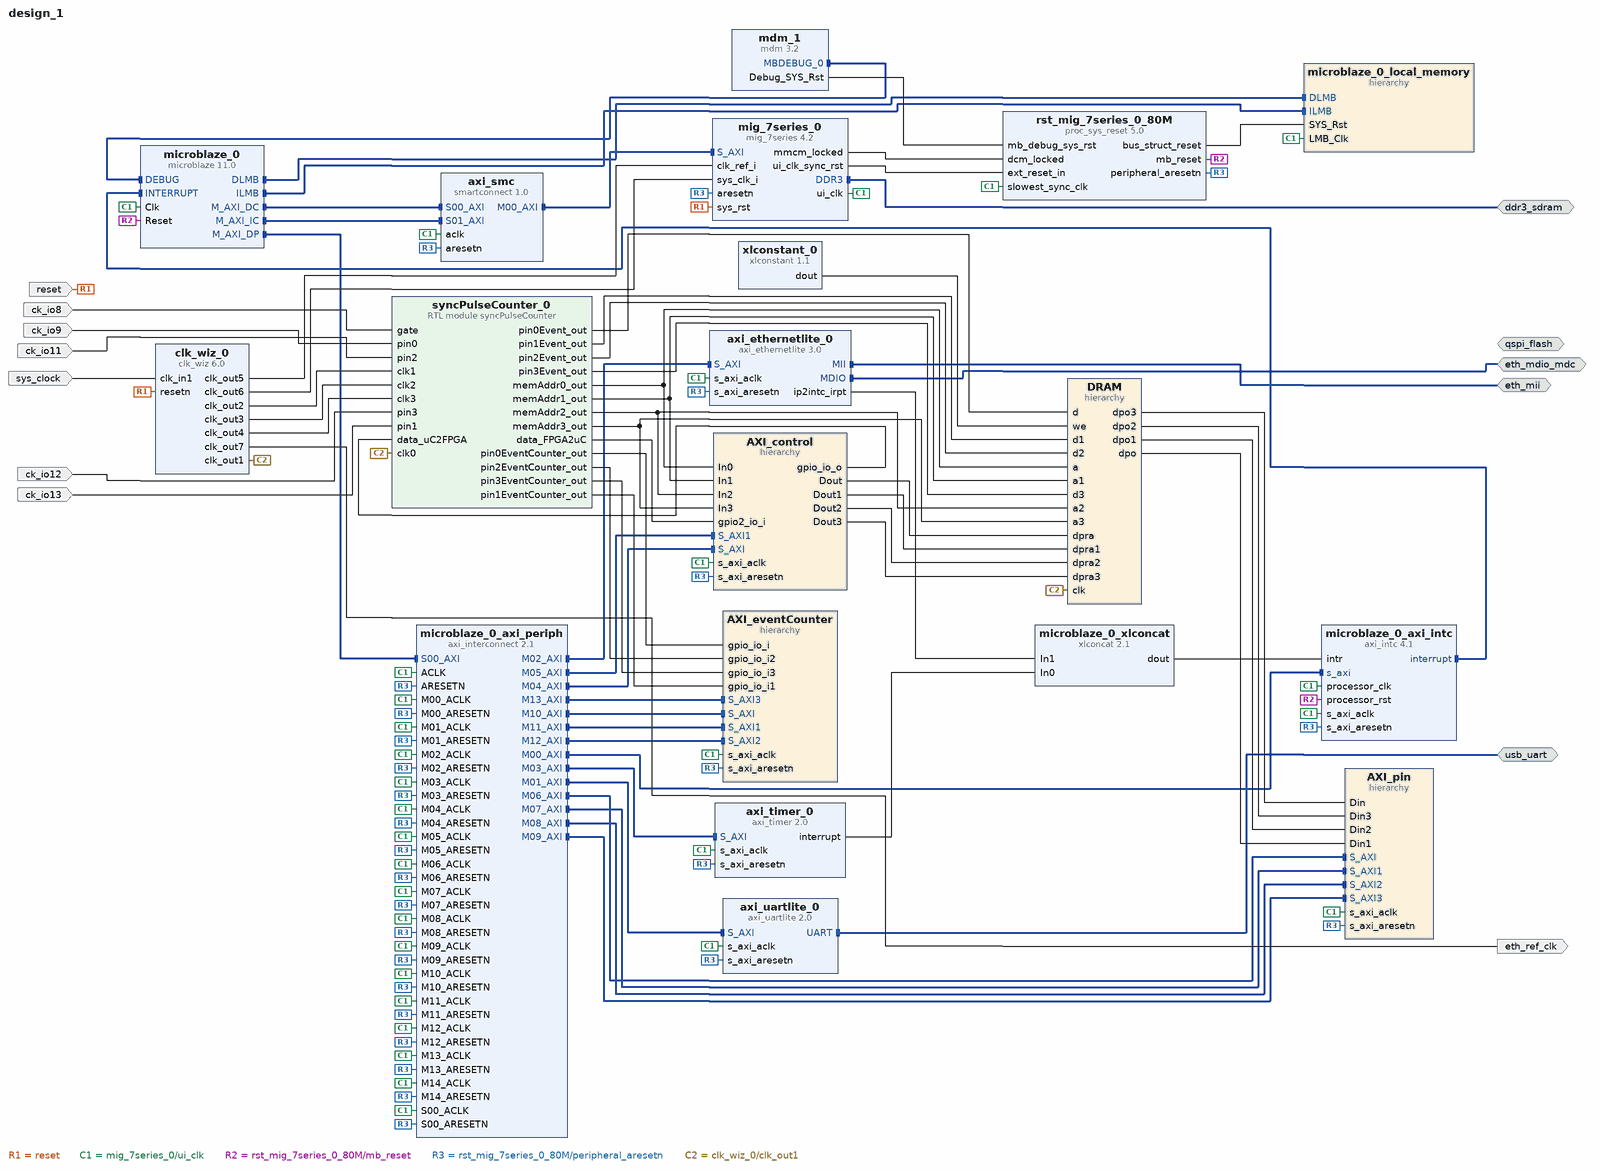
[diagram p0: block diagram of the top level]
# Vivado block design design_1, xc7a35ticsg324-1L, Vivado 2018.3
create_bd_design design_1

create_bd_intf_port -mode Master -vlnv xilinx.com:interface:ddrx_rtl:1.0 ddr3_sdram
create_bd_intf_port -mode Master -vlnv xilinx.com:interface:uart_rtl:1.0 usb_uart
create_bd_intf_port -mode Master -vlnv xilinx.com:interface:mii_rtl:1.0 eth_mii
create_bd_intf_port -mode Master -vlnv xilinx.com:interface:mdio_rtl:1.0 eth_mdio_mdc
create_bd_intf_port -mode Master -vlnv xilinx.com:interface:spi_rtl:1.0 qspi_flash
create_bd_port -dir I ck_io8
create_bd_port -dir I ck_io9
create_bd_port -dir I ck_io11
create_bd_port -dir I ck_io12
create_bd_port -dir I -type rst reset
set_property -dict {CONFIG.POLARITY ACTIVE_LOW} [get_bd_ports reset]
create_bd_port -dir I -type clk sys_clock
set_property -dict {CONFIG.FREQ_HZ 100000000 CONFIG.PHASE 0.000} [get_bd_ports sys_clock]
create_bd_port -dir O -type clk eth_ref_clk
create_bd_port -dir I ck_io13

create_bd_cell -type ip -vlnv xilinx.com:ip:clk_wiz:6.0 clk_wiz_0
set_property -dict [list \
  CONFIG.CLKOUT1_JITTER 126.455 \
  CONFIG.CLKOUT1_PHASE_ERROR 114.212 \
  CONFIG.CLKOUT1_REQUESTED_OUT_FREQ 200 \
  CONFIG.CLKOUT2_JITTER 126.455 \
  CONFIG.CLKOUT2_PHASE_ERROR 114.212 \
  CONFIG.CLKOUT2_REQUESTED_OUT_FREQ 200 \
  CONFIG.CLKOUT2_REQUESTED_PHASE 45 \
  CONFIG.CLKOUT2_USED true \
  CONFIG.CLKOUT3_JITTER 126.455 \
  CONFIG.CLKOUT3_PHASE_ERROR 114.212 \
  CONFIG.CLKOUT3_REQUESTED_OUT_FREQ 200 \
  CONFIG.CLKOUT3_REQUESTED_PHASE 90 \
  CONFIG.CLKOUT3_USED true \
  CONFIG.CLKOUT4_JITTER 126.455 \
  CONFIG.CLKOUT4_PHASE_ERROR 114.212 \
  CONFIG.CLKOUT4_REQUESTED_OUT_FREQ 200 \
  CONFIG.CLKOUT4_REQUESTED_PHASE 135 \
  CONFIG.CLKOUT4_USED true \
  CONFIG.CLKOUT5_JITTER 126.455 \
  CONFIG.CLKOUT5_PHASE_ERROR 114.212 \
  CONFIG.CLKOUT5_REQUESTED_OUT_FREQ 200 \
  CONFIG.CLKOUT5_USED true \
  CONFIG.CLKOUT6_JITTER 111.164 \
  CONFIG.CLKOUT6_PHASE_ERROR 114.212 \
  CONFIG.CLKOUT6_REQUESTED_OUT_FREQ 400 \
  CONFIG.CLKOUT6_USED true \
  CONFIG.CLKOUT7_JITTER 191.696 \
  CONFIG.CLKOUT7_PHASE_ERROR 114.212 \
  CONFIG.CLKOUT7_REQUESTED_OUT_FREQ 25 \
  CONFIG.CLKOUT7_USED true \
  CONFIG.CLK_IN1_BOARD_INTERFACE sys_clock \
  CONFIG.MMCM_CLKFBOUT_MULT_F 8.000 \
  CONFIG.MMCM_CLKIN1_PERIOD 10.000 \
  CONFIG.MMCM_CLKIN2_PERIOD 10.000 \
  CONFIG.MMCM_CLKOUT0_DIVIDE_F 4.000 \
  CONFIG.MMCM_CLKOUT1_DIVIDE 4 \
  CONFIG.MMCM_CLKOUT1_PHASE 45.000 \
  CONFIG.MMCM_CLKOUT2_DIVIDE 4 \
  CONFIG.MMCM_CLKOUT2_PHASE 90.000 \
  CONFIG.MMCM_CLKOUT3_DIVIDE 4 \
  CONFIG.MMCM_CLKOUT3_PHASE 135.000 \
  CONFIG.MMCM_CLKOUT4_DIVIDE 4 \
  CONFIG.MMCM_CLKOUT5_DIVIDE 2 \
  CONFIG.MMCM_CLKOUT6_DIVIDE 32 \
  CONFIG.MMCM_DIVCLK_DIVIDE 1 \
  CONFIG.NUM_OUT_CLKS 7 \
  CONFIG.RESET_BOARD_INTERFACE reset \
  CONFIG.RESET_PORT resetn \
  CONFIG.RESET_TYPE ACTIVE_LOW \
  CONFIG.USE_BOARD_FLOW true \
] [get_bd_cells clk_wiz_0]
create_bd_cell -type ip -vlnv xilinx.com:ip:xlconstant:1.1 xlconstant_0
create_bd_cell -type hier DRAM
create_bd_cell -type hier AXI_pin
create_bd_cell -type hier AXI_control
create_bd_cell -type ip -vlnv xilinx.com:ip:mig_7series:4.2 mig_7series_0
set_property -dict [list \
  CONFIG.BOARD_MIG_PARAM ddr3_sdram \
  CONFIG.MIG_DONT_TOUCH_PARAM Custom \
  CONFIG.RESET_BOARD_INTERFACE reset \
  CONFIG.XML_INPUT_FILE mig_b.prj \
] [get_bd_cells mig_7series_0]
create_bd_cell -type ip -vlnv xilinx.com:ip:axi_uartlite:2.0 axi_uartlite_0
set_property -dict {CONFIG.UARTLITE_BOARD_INTERFACE usb_uart CONFIG.USE_BOARD_FLOW true} [get_bd_cells axi_uartlite_0]
create_bd_cell -type ip -vlnv xilinx.com:ip:microblaze:11.0 microblaze_0
set_property -dict [list \
  CONFIG.C_CACHE_BYTE_SIZE 16384 \
  CONFIG.C_DCACHE_BYTE_SIZE 16384 \
  CONFIG.C_DEBUG_ENABLED 1 \
  CONFIG.C_D_AXI 1 \
  CONFIG.C_D_LMB 1 \
  CONFIG.C_I_LMB 1 \
  CONFIG.C_USE_DCACHE 1 \
  CONFIG.C_USE_ICACHE 1 \
] [get_bd_cells microblaze_0]
create_bd_cell -type hier microblaze_0_local_memory
create_bd_cell -type ip -vlnv xilinx.com:ip:axi_interconnect:2.1 microblaze_0_axi_periph
set_property -dict {CONFIG.NUM_MI 15} [get_bd_cells microblaze_0_axi_periph]
create_bd_cell -type ip -vlnv xilinx.com:ip:axi_intc:4.1 microblaze_0_axi_intc
set_property -dict {CONFIG.C_HAS_FAST 1} [get_bd_cells microblaze_0_axi_intc]
create_bd_cell -type ip -vlnv xilinx.com:ip:xlconcat:2.1 microblaze_0_xlconcat
create_bd_cell -type ip -vlnv xilinx.com:ip:mdm:3.2 mdm_1
create_bd_cell -type ip -vlnv xilinx.com:ip:proc_sys_reset:5.0 rst_mig_7series_0_80M
create_bd_cell -type ip -vlnv xilinx.com:ip:axi_ethernetlite:3.0 axi_ethernetlite_0
set_property -dict [list \
  CONFIG.MDIO_BOARD_INTERFACE eth_mdio_mdc \
  CONFIG.MII_BOARD_INTERFACE eth_mii \
  CONFIG.USE_BOARD_FLOW true \
] [get_bd_cells axi_ethernetlite_0]
create_bd_cell -type ip -vlnv xilinx.com:ip:axi_timer:2.0 axi_timer_0
create_bd_cell -type ip -vlnv xilinx.com:ip:smartconnect:1.0 axi_smc
set_property -dict {CONFIG.NUM_SI 2} [get_bd_cells axi_smc]
create_bd_cell -type hier AXI_eventCounter
create_bd_cell -type module -reference syncPulseCounter syncPulseCounter_0

# ---- hierarchy /DRAM ----
current_bd_instance /DRAM
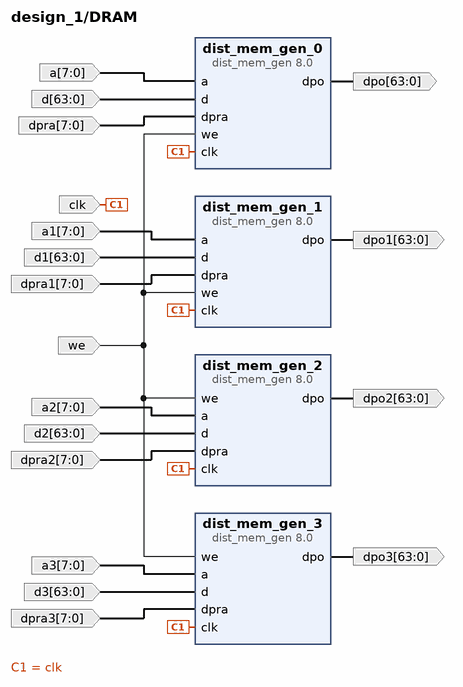
[diagram p1: block diagram inside /DRAM]
create_bd_pin -dir I -from 7 -to 0 a
create_bd_pin -dir I -from 63 -to 0 d
create_bd_pin -dir I -from 7 -to 0 dpra
create_bd_pin -dir I clk
create_bd_pin -dir I we
create_bd_pin -dir O -from 63 -to 0 dpo
create_bd_pin -dir I -from 7 -to 0 a1
create_bd_pin -dir I -from 63 -to 0 d1
create_bd_pin -dir I -from 7 -to 0 dpra1
create_bd_pin -dir O -from 63 -to 0 dpo1
create_bd_pin -dir I -from 7 -to 0 a2
create_bd_pin -dir I -from 63 -to 0 d2
create_bd_pin -dir I -from 7 -to 0 dpra2
create_bd_pin -dir O -from 63 -to 0 dpo2
create_bd_pin -dir I -from 7 -to 0 a3
create_bd_pin -dir I -from 63 -to 0 d3
create_bd_pin -dir I -from 7 -to 0 dpra3
create_bd_pin -dir O -from 63 -to 0 dpo3

create_bd_cell -type ip -vlnv xilinx.com:ip:dist_mem_gen:8.0 dist_mem_gen_0
set_property -dict {CONFIG.data_width 64 CONFIG.depth 256 CONFIG.memory_type dual_port_ram} [get_bd_cells dist_mem_gen_0]
create_bd_cell -type ip -vlnv xilinx.com:ip:dist_mem_gen:8.0 dist_mem_gen_1
set_property -dict {CONFIG.data_width 64 CONFIG.depth 256 CONFIG.memory_type dual_port_ram} [get_bd_cells dist_mem_gen_1]
create_bd_cell -type ip -vlnv xilinx.com:ip:dist_mem_gen:8.0 dist_mem_gen_2
set_property -dict {CONFIG.data_width 64 CONFIG.depth 256 CONFIG.memory_type dual_port_ram} [get_bd_cells dist_mem_gen_2]
create_bd_cell -type ip -vlnv xilinx.com:ip:dist_mem_gen:8.0 dist_mem_gen_3
set_property -dict {CONFIG.data_width 64 CONFIG.depth 256 CONFIG.memory_type dual_port_ram} [get_bd_cells dist_mem_gen_3]

# ---- hierarchy /AXI_pin ----
current_bd_instance /AXI_pin
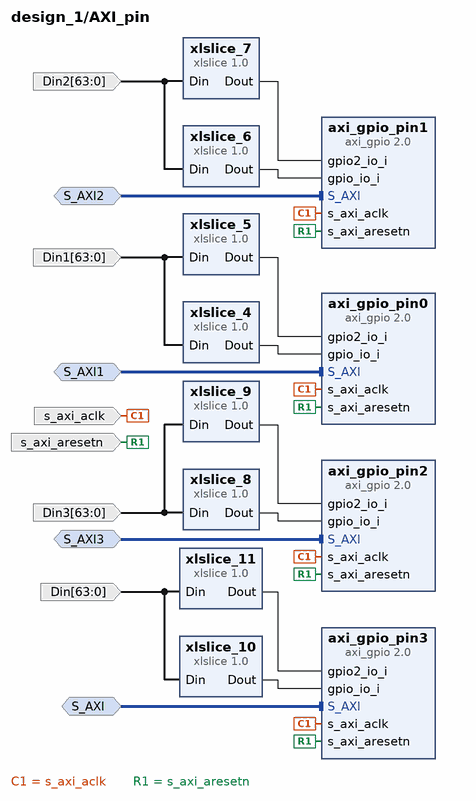
[diagram p2: block diagram inside /AXI_pin]
create_bd_intf_pin -mode Slave -vlnv xilinx.com:interface:aximm_rtl:1.0 S_AXI
create_bd_intf_pin -mode Slave -vlnv xilinx.com:interface:aximm_rtl:1.0 S_AXI1
create_bd_intf_pin -mode Slave -vlnv xilinx.com:interface:aximm_rtl:1.0 S_AXI2
create_bd_intf_pin -mode Slave -vlnv xilinx.com:interface:aximm_rtl:1.0 S_AXI3
create_bd_pin -dir I -from 63 -to 0 Din
create_bd_pin -dir I -from 63 -to 0 Din1
create_bd_pin -dir I -from 63 -to 0 Din2
create_bd_pin -dir I -from 63 -to 0 Din3
create_bd_pin -dir I -type clk s_axi_aclk
create_bd_pin -dir I -type rst s_axi_aresetn

create_bd_cell -type ip -vlnv xilinx.com:ip:axi_gpio:2.0 axi_gpio_pin3
set_property -dict [list \
  CONFIG.C_ALL_INPUTS 1 \
  CONFIG.C_ALL_INPUTS_2 1 \
  CONFIG.C_GPIO2_WIDTH 32 \
  CONFIG.C_IS_DUAL 1 \
] [get_bd_cells axi_gpio_pin3]
create_bd_cell -type ip -vlnv xilinx.com:ip:xlslice:1.0 xlslice_10
set_property -dict {CONFIG.DIN_FROM 31 CONFIG.DIN_TO 0 CONFIG.DIN_WIDTH 64 CONFIG.DOUT_WIDTH 32} [get_bd_cells xlslice_10]
create_bd_cell -type ip -vlnv xilinx.com:ip:xlslice:1.0 xlslice_4
set_property -dict {CONFIG.DIN_FROM 31 CONFIG.DIN_TO 0 CONFIG.DIN_WIDTH 64 CONFIG.DOUT_WIDTH 32} [get_bd_cells xlslice_4]
create_bd_cell -type ip -vlnv xilinx.com:ip:xlslice:1.0 xlslice_5
set_property -dict {CONFIG.DIN_FROM 63 CONFIG.DIN_TO 32 CONFIG.DIN_WIDTH 64 CONFIG.DOUT_WIDTH 32} [get_bd_cells xlslice_5]
create_bd_cell -type ip -vlnv xilinx.com:ip:xlslice:1.0 xlslice_6
set_property -dict {CONFIG.DIN_FROM 31 CONFIG.DIN_TO 0 CONFIG.DIN_WIDTH 64 CONFIG.DOUT_WIDTH 32} [get_bd_cells xlslice_6]
create_bd_cell -type ip -vlnv xilinx.com:ip:axi_gpio:2.0 axi_gpio_pin0
set_property -dict [list \
  CONFIG.C_ALL_INPUTS 1 \
  CONFIG.C_ALL_INPUTS_2 1 \
  CONFIG.C_GPIO2_WIDTH 32 \
  CONFIG.C_IS_DUAL 1 \
] [get_bd_cells axi_gpio_pin0]
create_bd_cell -type ip -vlnv xilinx.com:ip:xlslice:1.0 xlslice_7
set_property -dict {CONFIG.DIN_FROM 63 CONFIG.DIN_TO 32 CONFIG.DIN_WIDTH 64 CONFIG.DOUT_WIDTH 1} [get_bd_cells xlslice_7]
create_bd_cell -type ip -vlnv xilinx.com:ip:xlslice:1.0 xlslice_8
set_property -dict {CONFIG.DIN_FROM 31 CONFIG.DIN_TO 0 CONFIG.DIN_WIDTH 64 CONFIG.DOUT_WIDTH 32} [get_bd_cells xlslice_8]
create_bd_cell -type ip -vlnv xilinx.com:ip:axi_gpio:2.0 axi_gpio_pin1
set_property -dict [list \
  CONFIG.C_ALL_INPUTS 1 \
  CONFIG.C_ALL_INPUTS_2 1 \
  CONFIG.C_GPIO2_WIDTH 32 \
  CONFIG.C_IS_DUAL 1 \
] [get_bd_cells axi_gpio_pin1]
create_bd_cell -type ip -vlnv xilinx.com:ip:axi_gpio:2.0 axi_gpio_pin2
set_property -dict [list \
  CONFIG.C_ALL_INPUTS 1 \
  CONFIG.C_ALL_INPUTS_2 1 \
  CONFIG.C_GPIO2_WIDTH 32 \
  CONFIG.C_IS_DUAL 1 \
] [get_bd_cells axi_gpio_pin2]
create_bd_cell -type ip -vlnv xilinx.com:ip:xlslice:1.0 xlslice_9
set_property -dict {CONFIG.DIN_FROM 63 CONFIG.DIN_TO 32 CONFIG.DIN_WIDTH 64 CONFIG.DOUT_WIDTH 1} [get_bd_cells xlslice_9]
create_bd_cell -type ip -vlnv xilinx.com:ip:xlslice:1.0 xlslice_11
set_property -dict {CONFIG.DIN_FROM 63 CONFIG.DIN_TO 32 CONFIG.DIN_WIDTH 64 CONFIG.DOUT_WIDTH 1} [get_bd_cells xlslice_11]

# ---- hierarchy /AXI_control ----
current_bd_instance /AXI_control
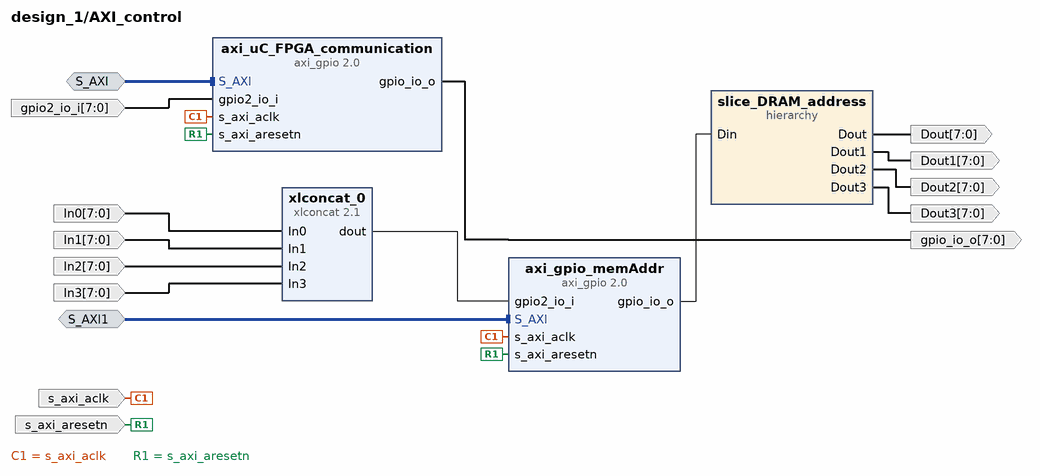
[diagram p3: block diagram inside /AXI_control]
create_bd_intf_pin -mode Slave -vlnv xilinx.com:interface:aximm_rtl:1.0 S_AXI
create_bd_intf_pin -mode Slave -vlnv xilinx.com:interface:aximm_rtl:1.0 S_AXI1
create_bd_pin -dir O -from 7 -to 0 gpio_io_o
create_bd_pin -dir I -from 7 -to 0 gpio2_io_i
create_bd_pin -dir I -from 7 -to 0 In0
create_bd_pin -dir I -from 7 -to 0 In1
create_bd_pin -dir I -from 7 -to 0 In2
create_bd_pin -dir I -from 7 -to 0 In3
create_bd_pin -dir O -from 7 -to 0 Dout
create_bd_pin -dir O -from 7 -to 0 Dout1
create_bd_pin -dir O -from 7 -to 0 Dout2
create_bd_pin -dir O -from 7 -to 0 Dout3
create_bd_pin -dir I -type clk s_axi_aclk
create_bd_pin -dir I -type rst s_axi_aresetn

create_bd_cell -type ip -vlnv xilinx.com:ip:axi_gpio:2.0 axi_uC_FPGA_communication
set_property -dict [list \
  CONFIG.C_ALL_INPUTS 0 \
  CONFIG.C_ALL_INPUTS_2 1 \
  CONFIG.C_ALL_OUTPUTS 1 \
  CONFIG.C_GPIO2_WIDTH 8 \
  CONFIG.C_GPIO_WIDTH 8 \
  CONFIG.C_IS_DUAL 1 \
] [get_bd_cells axi_uC_FPGA_communication]
create_bd_cell -type ip -vlnv xilinx.com:ip:axi_gpio:2.0 axi_gpio_memAddr
set_property -dict [list \
  CONFIG.C_ALL_INPUTS 0 \
  CONFIG.C_ALL_INPUTS_2 1 \
  CONFIG.C_ALL_OUTPUTS 1 \
  CONFIG.C_GPIO2_WIDTH 32 \
  CONFIG.C_GPIO_WIDTH 32 \
  CONFIG.C_IS_DUAL 1 \
] [get_bd_cells axi_gpio_memAddr]
create_bd_cell -type ip -vlnv xilinx.com:ip:xlconcat:2.1 xlconcat_0
set_property -dict [list \
  CONFIG.IN0_WIDTH 8 \
  CONFIG.IN1_WIDTH 8 \
  CONFIG.IN2_WIDTH 8 \
  CONFIG.IN3_WIDTH 8 \
  CONFIG.NUM_PORTS 4 \
] [get_bd_cells xlconcat_0]
create_bd_cell -type hier slice_DRAM_address

# ---- hierarchy /AXI_control/slice_DRAM_address ----
current_bd_instance /AXI_control/slice_DRAM_address
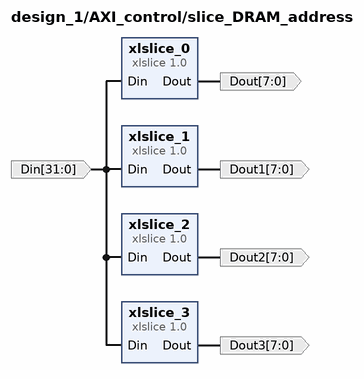
[diagram p4: block diagram inside /AXI_control/slice_DRAM_address]
create_bd_pin -dir I -from 31 -to 0 Din
create_bd_pin -dir O -from 7 -to 0 Dout
create_bd_pin -dir O -from 7 -to 0 Dout1
create_bd_pin -dir O -from 7 -to 0 Dout2
create_bd_pin -dir O -from 7 -to 0 Dout3

create_bd_cell -type ip -vlnv xilinx.com:ip:xlslice:1.0 xlslice_0
set_property -dict {CONFIG.DIN_FROM 7 CONFIG.DOUT_WIDTH 8} [get_bd_cells xlslice_0]
create_bd_cell -type ip -vlnv xilinx.com:ip:xlslice:1.0 xlslice_1
set_property -dict {CONFIG.DIN_FROM 15 CONFIG.DIN_TO 8 CONFIG.DOUT_WIDTH 8} [get_bd_cells xlslice_1]
create_bd_cell -type ip -vlnv xilinx.com:ip:xlslice:1.0 xlslice_2
set_property -dict {CONFIG.DIN_FROM 23 CONFIG.DIN_TO 16 CONFIG.DOUT_WIDTH 8} [get_bd_cells xlslice_2]
create_bd_cell -type ip -vlnv xilinx.com:ip:xlslice:1.0 xlslice_3
set_property -dict {CONFIG.DIN_FROM 31 CONFIG.DIN_TO 24 CONFIG.DOUT_WIDTH 8} [get_bd_cells xlslice_3]

# ---- hierarchy /microblaze_0_local_memory ----
current_bd_instance /microblaze_0_local_memory
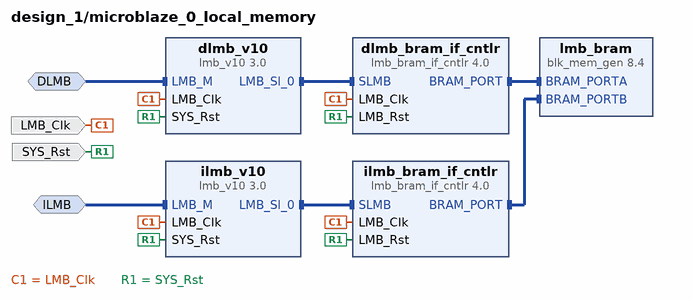
[diagram p5: block diagram inside /microblaze_0_local_memory]
create_bd_intf_pin -mode MirroredMaster -vlnv xilinx.com:interface:lmb_rtl:1.0 DLMB
create_bd_intf_pin -mode MirroredMaster -vlnv xilinx.com:interface:lmb_rtl:1.0 ILMB
create_bd_pin -dir I -type clk LMB_Clk
create_bd_pin -dir I -type rst SYS_Rst

create_bd_cell -type ip -vlnv xilinx.com:ip:lmb_v10:3.0 dlmb_v10
create_bd_cell -type ip -vlnv xilinx.com:ip:lmb_v10:3.0 ilmb_v10
create_bd_cell -type ip -vlnv xilinx.com:ip:lmb_bram_if_cntlr:4.0 dlmb_bram_if_cntlr
set_property -dict {CONFIG.C_ECC 0} [get_bd_cells dlmb_bram_if_cntlr]
create_bd_cell -type ip -vlnv xilinx.com:ip:lmb_bram_if_cntlr:4.0 ilmb_bram_if_cntlr
set_property -dict {CONFIG.C_ECC 0} [get_bd_cells ilmb_bram_if_cntlr]
create_bd_cell -type ip -vlnv xilinx.com:ip:blk_mem_gen:8.4 lmb_bram
set_property -dict {CONFIG.Memory_Type True_Dual_Port_RAM CONFIG.use_bram_block BRAM_Controller} [get_bd_cells lmb_bram]

# ---- hierarchy /AXI_eventCounter ----
current_bd_instance /AXI_eventCounter
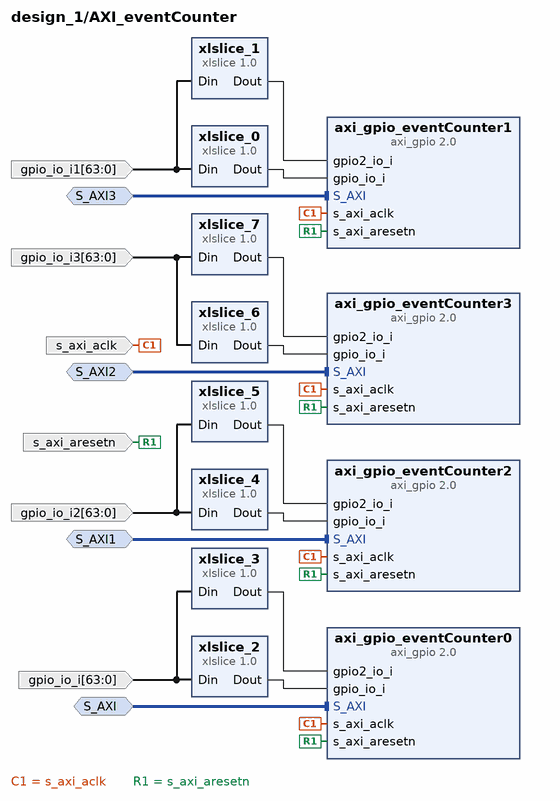
[diagram p6: block diagram inside /AXI_eventCounter]
create_bd_intf_pin -mode Slave -vlnv xilinx.com:interface:aximm_rtl:1.0 S_AXI
create_bd_intf_pin -mode Slave -vlnv xilinx.com:interface:aximm_rtl:1.0 S_AXI1
create_bd_intf_pin -mode Slave -vlnv xilinx.com:interface:aximm_rtl:1.0 S_AXI2
create_bd_intf_pin -mode Slave -vlnv xilinx.com:interface:aximm_rtl:1.0 S_AXI3
create_bd_pin -dir I -from 63 -to 0 gpio_io_i
create_bd_pin -dir I -from 63 -to 0 gpio_io_i2
create_bd_pin -dir I -from 63 -to 0 gpio_io_i3
create_bd_pin -dir I -from 63 -to 0 gpio_io_i1
create_bd_pin -dir I -type clk s_axi_aclk
create_bd_pin -dir I -type rst s_axi_aresetn

create_bd_cell -type ip -vlnv xilinx.com:ip:axi_gpio:2.0 axi_gpio_eventCounter0
set_property -dict {CONFIG.C_ALL_INPUTS 1 CONFIG.C_ALL_INPUTS_2 1 CONFIG.C_IS_DUAL 1} [get_bd_cells axi_gpio_eventCounter0]
create_bd_cell -type ip -vlnv xilinx.com:ip:axi_gpio:2.0 axi_gpio_eventCounter2
set_property -dict {CONFIG.C_ALL_INPUTS 1 CONFIG.C_ALL_INPUTS_2 1 CONFIG.C_IS_DUAL 1} [get_bd_cells axi_gpio_eventCounter2]
create_bd_cell -type ip -vlnv xilinx.com:ip:axi_gpio:2.0 axi_gpio_eventCounter3
set_property -dict {CONFIG.C_ALL_INPUTS 1 CONFIG.C_ALL_INPUTS_2 1 CONFIG.C_IS_DUAL 1} [get_bd_cells axi_gpio_eventCounter3]
create_bd_cell -type ip -vlnv xilinx.com:ip:axi_gpio:2.0 axi_gpio_eventCounter1
set_property -dict [list \
  CONFIG.C_ALL_INPUTS 1 \
  CONFIG.C_ALL_INPUTS_2 1 \
  CONFIG.C_INTERRUPT_PRESENT 0 \
  CONFIG.C_IS_DUAL 1 \
] [get_bd_cells axi_gpio_eventCounter1]
create_bd_cell -type ip -vlnv xilinx.com:ip:xlslice:1.0 xlslice_0
set_property -dict {CONFIG.DIN_FROM 31 CONFIG.DIN_TO 0 CONFIG.DIN_WIDTH 64 CONFIG.DOUT_WIDTH 32} [get_bd_cells xlslice_0]
create_bd_cell -type ip -vlnv xilinx.com:ip:xlslice:1.0 xlslice_1
set_property -dict {CONFIG.DIN_FROM 63 CONFIG.DIN_TO 32 CONFIG.DIN_WIDTH 64 CONFIG.DOUT_WIDTH 32} [get_bd_cells xlslice_1]
create_bd_cell -type ip -vlnv xilinx.com:ip:xlslice:1.0 xlslice_2
set_property -dict {CONFIG.DIN_FROM 31 CONFIG.DIN_TO 0 CONFIG.DIN_WIDTH 64 CONFIG.DOUT_WIDTH 32} [get_bd_cells xlslice_2]
create_bd_cell -type ip -vlnv xilinx.com:ip:xlslice:1.0 xlslice_3
set_property -dict {CONFIG.DIN_FROM 63 CONFIG.DIN_TO 32 CONFIG.DIN_WIDTH 64 CONFIG.DOUT_WIDTH 1} [get_bd_cells xlslice_3]
create_bd_cell -type ip -vlnv xilinx.com:ip:xlslice:1.0 xlslice_4
set_property -dict {CONFIG.DIN_FROM 31 CONFIG.DIN_TO 0 CONFIG.DIN_WIDTH 64 CONFIG.DOUT_WIDTH 32} [get_bd_cells xlslice_4]
create_bd_cell -type ip -vlnv xilinx.com:ip:xlslice:1.0 xlslice_5
set_property -dict {CONFIG.DIN_FROM 63 CONFIG.DIN_TO 32 CONFIG.DIN_WIDTH 64 CONFIG.DOUT_WIDTH 1} [get_bd_cells xlslice_5]
create_bd_cell -type ip -vlnv xilinx.com:ip:xlslice:1.0 xlslice_6
set_property -dict {CONFIG.DIN_FROM 31 CONFIG.DIN_TO 0 CONFIG.DIN_WIDTH 64 CONFIG.DOUT_WIDTH 32} [get_bd_cells xlslice_6]
create_bd_cell -type ip -vlnv xilinx.com:ip:xlslice:1.0 xlslice_7
set_property -dict {CONFIG.DIN_FROM 63 CONFIG.DIN_TO 32 CONFIG.DIN_WIDTH 64 CONFIG.DOUT_WIDTH 1} [get_bd_cells xlslice_7]

# ---- connections ----

current_bd_instance /DRAM
connect_bd_net -net syncPulseCounter_0_memAddr0_out [get_bd_pins a] [get_bd_pins dist_mem_gen_0/a]
connect_bd_net -net syncPulseCounter_0_pin0Event_out [get_bd_pins d] [get_bd_pins dist_mem_gen_0/d]
connect_bd_net -net xlslice_0_Dout [get_bd_pins dpra] [get_bd_pins dist_mem_gen_0/dpra]
connect_bd_net -net clk_wiz_0_clk_out1 [get_bd_pins clk] \
  [get_bd_pins dist_mem_gen_1/clk] [get_bd_pins dist_mem_gen_2/clk] [get_bd_pins dist_mem_gen_3/clk] \
  [get_bd_pins dist_mem_gen_0/clk]
connect_bd_net -net xlconstant_0_dout [get_bd_pins we] \
  [get_bd_pins dist_mem_gen_3/we] [get_bd_pins dist_mem_gen_2/we] [get_bd_pins dist_mem_gen_1/we] \
  [get_bd_pins dist_mem_gen_0/we]
connect_bd_net [get_bd_pins dist_mem_gen_0/dpo] [get_bd_pins dpo]
connect_bd_net -net syncPulseCounter_0_memAddr1_out [get_bd_pins a1] [get_bd_pins dist_mem_gen_1/a]
connect_bd_net -net syncPulseCounter_0_pin1Event_out [get_bd_pins d1] [get_bd_pins dist_mem_gen_1/d]
connect_bd_net -net xlslice_1_Dout [get_bd_pins dpra1] [get_bd_pins dist_mem_gen_1/dpra]
connect_bd_net [get_bd_pins dist_mem_gen_1/dpo] [get_bd_pins dpo1]
connect_bd_net -net syncPulseCounter_0_memAddr2_out [get_bd_pins a2] [get_bd_pins dist_mem_gen_2/a]
connect_bd_net -net syncPulseCounter_0_pin2Event_out [get_bd_pins d2] [get_bd_pins dist_mem_gen_2/d]
connect_bd_net -net xlslice_2_Dout [get_bd_pins dpra2] [get_bd_pins dist_mem_gen_2/dpra]
connect_bd_net [get_bd_pins dist_mem_gen_2/dpo] [get_bd_pins dpo2]
connect_bd_net -net syncPulseCounter_0_memAddr3_out [get_bd_pins a3] [get_bd_pins dist_mem_gen_3/a]
connect_bd_net -net syncPulseCounter_0_pin3Event_out [get_bd_pins d3] [get_bd_pins dist_mem_gen_3/d]
connect_bd_net -net xlslice_3_Dout [get_bd_pins dpra3] [get_bd_pins dist_mem_gen_3/dpra]
connect_bd_net [get_bd_pins dist_mem_gen_3/dpo] [get_bd_pins dpo3]

current_bd_instance /AXI_pin
connect_bd_intf_net [get_bd_intf_pins S_AXI2] [get_bd_intf_pins axi_gpio_pin1/S_AXI]
connect_bd_intf_net [get_bd_intf_pins S_AXI3] [get_bd_intf_pins axi_gpio_pin2/S_AXI]
connect_bd_intf_net [get_bd_intf_pins S_AXI] [get_bd_intf_pins axi_gpio_pin3/S_AXI]
connect_bd_intf_net [get_bd_intf_pins S_AXI1] [get_bd_intf_pins axi_gpio_pin0/S_AXI]
connect_bd_net [get_bd_pins xlslice_10/Dout] [get_bd_pins axi_gpio_pin3/gpio_io_i]
connect_bd_net [get_bd_pins xlslice_11/Dout] [get_bd_pins axi_gpio_pin3/gpio2_io_i]
connect_bd_net [get_bd_pins xlslice_4/Dout] [get_bd_pins axi_gpio_pin0/gpio_io_i]
connect_bd_net [get_bd_pins xlslice_5/Dout] [get_bd_pins axi_gpio_pin0/gpio2_io_i]
connect_bd_net [get_bd_pins xlslice_6/Dout] [get_bd_pins axi_gpio_pin1/gpio_io_i]
connect_bd_net [get_bd_pins xlslice_7/Dout] [get_bd_pins axi_gpio_pin1/gpio2_io_i]
connect_bd_net [get_bd_pins xlslice_8/Dout] [get_bd_pins axi_gpio_pin2/gpio_io_i]
connect_bd_net [get_bd_pins xlslice_9/Dout] [get_bd_pins axi_gpio_pin2/gpio2_io_i]
connect_bd_net [get_bd_pins Din] [get_bd_pins xlslice_11/Din] [get_bd_pins xlslice_10/Din]
connect_bd_net -net dist_mem_gen_0_dpo [get_bd_pins Din1] [get_bd_pins xlslice_5/Din] [get_bd_pins xlslice_4/Din]
connect_bd_net [get_bd_pins Din2] [get_bd_pins xlslice_7/Din] [get_bd_pins xlslice_6/Din]
connect_bd_net [get_bd_pins Din3] [get_bd_pins xlslice_9/Din] [get_bd_pins xlslice_8/Din]
connect_bd_net [get_bd_pins s_axi_aclk] \
  [get_bd_pins axi_gpio_pin3/s_axi_aclk] [get_bd_pins axi_gpio_pin0/s_axi_aclk] [get_bd_pins axi_gpio_pin1/s_axi_aclk] \
  [get_bd_pins axi_gpio_pin2/s_axi_aclk]
connect_bd_net [get_bd_pins s_axi_aresetn] \
  [get_bd_pins axi_gpio_pin3/s_axi_aresetn] [get_bd_pins axi_gpio_pin0/s_axi_aresetn] \
  [get_bd_pins axi_gpio_pin1/s_axi_aresetn] [get_bd_pins axi_gpio_pin2/s_axi_aresetn]

current_bd_instance /AXI_control
connect_bd_intf_net [get_bd_intf_pins S_AXI1] [get_bd_intf_pins axi_gpio_memAddr/S_AXI]
connect_bd_intf_net [get_bd_intf_pins S_AXI] [get_bd_intf_pins axi_uC_FPGA_communication/S_AXI]
connect_bd_net [get_bd_pins axi_gpio_memAddr/gpio_io_o] [get_bd_pins slice_DRAM_address/Din]
connect_bd_net [get_bd_pins xlconcat_0/dout] [get_bd_pins axi_gpio_memAddr/gpio2_io_i]
connect_bd_net -net axi_gpio_0_gpio_io_o [get_bd_pins axi_uC_FPGA_communication/gpio_io_o] [get_bd_pins gpio_io_o]
connect_bd_net -net syncPulseCounter_0_data_FPGA2uC [get_bd_pins gpio2_io_i] [get_bd_pins axi_uC_FPGA_communication/gpio2_io_i]
connect_bd_net -net syncPulseCounter_0_memAddr0_out [get_bd_pins In0] [get_bd_pins xlconcat_0/In0]
connect_bd_net -net syncPulseCounter_0_memAddr1_out [get_bd_pins In1] [get_bd_pins xlconcat_0/In1]
connect_bd_net -net syncPulseCounter_0_memAddr2_out [get_bd_pins In2] [get_bd_pins xlconcat_0/In2]
connect_bd_net -net syncPulseCounter_0_memAddr3_out [get_bd_pins In3] [get_bd_pins xlconcat_0/In3]
connect_bd_net -net xlslice_0_Dout [get_bd_pins slice_DRAM_address/Dout] [get_bd_pins Dout]
connect_bd_net -net xlslice_1_Dout [get_bd_pins slice_DRAM_address/Dout1] [get_bd_pins Dout1]
connect_bd_net -net xlslice_2_Dout [get_bd_pins slice_DRAM_address/Dout2] [get_bd_pins Dout2]
connect_bd_net -net xlslice_3_Dout [get_bd_pins slice_DRAM_address/Dout3] [get_bd_pins Dout3]
connect_bd_net [get_bd_pins s_axi_aclk] [get_bd_pins axi_uC_FPGA_communication/s_axi_aclk] [get_bd_pins axi_gpio_memAddr/s_axi_aclk]
connect_bd_net [get_bd_pins s_axi_aresetn] [get_bd_pins axi_uC_FPGA_communication/s_axi_aresetn] [get_bd_pins axi_gpio_memAddr/s_axi_aresetn]

current_bd_instance /AXI_control/slice_DRAM_address
connect_bd_net [get_bd_pins Din] [get_bd_pins xlslice_1/Din] [get_bd_pins xlslice_2/Din] [get_bd_pins xlslice_3/Din] [get_bd_pins xlslice_0/Din]
connect_bd_net [get_bd_pins xlslice_0/Dout] [get_bd_pins Dout]
connect_bd_net [get_bd_pins xlslice_1/Dout] [get_bd_pins Dout1]
connect_bd_net [get_bd_pins xlslice_2/Dout] [get_bd_pins Dout2]
connect_bd_net [get_bd_pins xlslice_3/Dout] [get_bd_pins Dout3]

current_bd_instance /microblaze_0_local_memory
connect_bd_intf_net -intf_net microblaze_0_dlmb_cntlr [get_bd_intf_pins dlmb_bram_if_cntlr/BRAM_PORT] [get_bd_intf_pins lmb_bram/BRAM_PORTA]
connect_bd_intf_net -intf_net microblaze_0_dlmb_bus [get_bd_intf_pins dlmb_v10/LMB_Sl_0] [get_bd_intf_pins dlmb_bram_if_cntlr/SLMB]
connect_bd_intf_net -intf_net microblaze_0_dlmb [get_bd_intf_pins DLMB] [get_bd_intf_pins dlmb_v10/LMB_M]
connect_bd_intf_net -intf_net microblaze_0_ilmb_bus [get_bd_intf_pins ilmb_v10/LMB_Sl_0] [get_bd_intf_pins ilmb_bram_if_cntlr/SLMB]
connect_bd_intf_net -intf_net microblaze_0_ilmb_cntlr [get_bd_intf_pins ilmb_bram_if_cntlr/BRAM_PORT] [get_bd_intf_pins lmb_bram/BRAM_PORTB]
connect_bd_intf_net -intf_net microblaze_0_ilmb [get_bd_intf_pins ILMB] [get_bd_intf_pins ilmb_v10/LMB_M]
connect_bd_net -net microblaze_0_Clk [get_bd_pins LMB_Clk] \
  [get_bd_pins dlmb_v10/LMB_Clk] [get_bd_pins dlmb_bram_if_cntlr/LMB_Clk] [get_bd_pins ilmb_v10/LMB_Clk] \
  [get_bd_pins ilmb_bram_if_cntlr/LMB_Clk]
connect_bd_net [get_bd_pins SYS_Rst] \
  [get_bd_pins dlmb_v10/SYS_Rst] [get_bd_pins dlmb_bram_if_cntlr/LMB_Rst] [get_bd_pins ilmb_v10/SYS_Rst] \
  [get_bd_pins ilmb_bram_if_cntlr/LMB_Rst]
set_property HDL_ATTRIBUTE.BMM_INFO_ADDRESS_SPACE {byte  0x00000000 32 > design_1 microblaze_0_local_memory/lmb_bram} [get_bd_cells dlmb_bram_if_cntlr]
set_property HDL_ATTRIBUTE.KEEP_HIERARCHY yes [get_bd_cells dlmb_bram_if_cntlr]

current_bd_instance /AXI_eventCounter
connect_bd_intf_net [get_bd_intf_pins S_AXI1] [get_bd_intf_pins axi_gpio_eventCounter2/S_AXI]
connect_bd_intf_net [get_bd_intf_pins S_AXI2] [get_bd_intf_pins axi_gpio_eventCounter3/S_AXI]
connect_bd_intf_net [get_bd_intf_pins S_AXI] [get_bd_intf_pins axi_gpio_eventCounter0/S_AXI]
connect_bd_intf_net [get_bd_intf_pins S_AXI3] [get_bd_intf_pins axi_gpio_eventCounter1/S_AXI]
connect_bd_net [get_bd_pins s_axi_aclk] \
  [get_bd_pins axi_gpio_eventCounter0/s_axi_aclk] [get_bd_pins axi_gpio_eventCounter2/s_axi_aclk] \
  [get_bd_pins axi_gpio_eventCounter3/s_axi_aclk] [get_bd_pins axi_gpio_eventCounter1/s_axi_aclk]
connect_bd_net [get_bd_pins s_axi_aresetn] \
  [get_bd_pins axi_gpio_eventCounter0/s_axi_aresetn] [get_bd_pins axi_gpio_eventCounter2/s_axi_aresetn] \
  [get_bd_pins axi_gpio_eventCounter3/s_axi_aresetn] [get_bd_pins axi_gpio_eventCounter1/s_axi_aresetn]
connect_bd_net -net gpio_io_i1_1 [get_bd_pins gpio_io_i1] [get_bd_pins xlslice_0/Din] [get_bd_pins xlslice_1/Din]
connect_bd_net [get_bd_pins xlslice_0/Dout] [get_bd_pins axi_gpio_eventCounter1/gpio_io_i]
connect_bd_net [get_bd_pins xlslice_1/Dout] [get_bd_pins axi_gpio_eventCounter1/gpio2_io_i]
connect_bd_net [get_bd_pins gpio_io_i] [get_bd_pins xlslice_2/Din] [get_bd_pins xlslice_3/Din]
connect_bd_net [get_bd_pins xlslice_2/Dout] [get_bd_pins axi_gpio_eventCounter0/gpio_io_i]
connect_bd_net [get_bd_pins xlslice_3/Dout] [get_bd_pins axi_gpio_eventCounter0/gpio2_io_i]
connect_bd_net -net gpio_io_i2_1 [get_bd_pins gpio_io_i2] [get_bd_pins xlslice_4/Din] [get_bd_pins xlslice_5/Din]
connect_bd_net [get_bd_pins xlslice_4/Dout] [get_bd_pins axi_gpio_eventCounter2/gpio_io_i]
connect_bd_net [get_bd_pins xlslice_5/Dout] [get_bd_pins axi_gpio_eventCounter2/gpio2_io_i]
connect_bd_net -net gpio_io_i3_1 [get_bd_pins gpio_io_i3] [get_bd_pins xlslice_6/Din] [get_bd_pins xlslice_7/Din]
connect_bd_net [get_bd_pins xlslice_6/Dout] [get_bd_pins axi_gpio_eventCounter3/gpio_io_i]
connect_bd_net [get_bd_pins xlslice_7/Dout] [get_bd_pins axi_gpio_eventCounter3/gpio2_io_i]

current_bd_instance /
connect_bd_intf_net [get_bd_intf_pins microblaze_0_axi_periph/M06_AXI] [get_bd_intf_pins AXI_pin/S_AXI]
connect_bd_intf_net [get_bd_intf_pins microblaze_0_axi_periph/M13_AXI] [get_bd_intf_pins AXI_eventCounter/S_AXI3]
connect_bd_intf_net [get_bd_intf_ports eth_mii] [get_bd_intf_pins axi_ethernetlite_0/MII]
connect_bd_intf_net [get_bd_intf_pins microblaze_0_axi_periph/M07_AXI] [get_bd_intf_pins AXI_pin/S_AXI1]
connect_bd_intf_net [get_bd_intf_pins microblaze_0_axi_periph/M10_AXI] [get_bd_intf_pins AXI_eventCounter/S_AXI]
connect_bd_intf_net [get_bd_intf_pins microblaze_0_axi_periph/M11_AXI] [get_bd_intf_pins AXI_eventCounter/S_AXI1]
connect_bd_intf_net [get_bd_intf_pins axi_smc/M00_AXI] [get_bd_intf_pins mig_7series_0/S_AXI]
connect_bd_intf_net [get_bd_intf_pins microblaze_0_axi_periph/M12_AXI] [get_bd_intf_pins AXI_eventCounter/S_AXI2]
connect_bd_intf_net [get_bd_intf_pins microblaze_0_axi_periph/M08_AXI] [get_bd_intf_pins AXI_pin/S_AXI2]
connect_bd_intf_net [get_bd_intf_pins microblaze_0/DLMB] [get_bd_intf_pins microblaze_0_local_memory/DLMB]
connect_bd_intf_net [get_bd_intf_pins microblaze_0_axi_periph/M03_AXI] [get_bd_intf_pins axi_timer_0/S_AXI]
connect_bd_intf_net [get_bd_intf_pins microblaze_0/M_AXI_DC] [get_bd_intf_pins axi_smc/S00_AXI]
connect_bd_intf_net [get_bd_intf_ports eth_mdio_mdc] [get_bd_intf_pins axi_ethernetlite_0/MDIO]
connect_bd_intf_net -intf_net microblaze_0_intc_axi [get_bd_intf_pins microblaze_0_axi_periph/M00_AXI] [get_bd_intf_pins microblaze_0_axi_intc/s_axi]
connect_bd_intf_net [get_bd_intf_pins microblaze_0/ILMB] [get_bd_intf_pins microblaze_0_local_memory/ILMB]
connect_bd_intf_net -intf_net microblaze_0_axi_dp [get_bd_intf_pins microblaze_0_axi_periph/S00_AXI] [get_bd_intf_pins microblaze_0/M_AXI_DP]
connect_bd_intf_net [get_bd_intf_pins microblaze_0_axi_periph/M09_AXI] [get_bd_intf_pins AXI_pin/S_AXI3]
connect_bd_intf_net [get_bd_intf_pins microblaze_0_axi_periph/M02_AXI] [get_bd_intf_pins axi_ethernetlite_0/S_AXI]
connect_bd_intf_net [get_bd_intf_ports usb_uart] [get_bd_intf_pins axi_uartlite_0/UART]
connect_bd_intf_net [get_bd_intf_ports ddr3_sdram] [get_bd_intf_pins mig_7series_0/DDR3]
connect_bd_intf_net [get_bd_intf_pins microblaze_0_axi_periph/M05_AXI] [get_bd_intf_pins AXI_control/S_AXI1]
connect_bd_intf_net [get_bd_intf_pins microblaze_0_axi_periph/M04_AXI] [get_bd_intf_pins AXI_control/S_AXI]
connect_bd_intf_net [get_bd_intf_pins microblaze_0_axi_periph/M01_AXI] [get_bd_intf_pins axi_uartlite_0/S_AXI]
connect_bd_intf_net [get_bd_intf_pins microblaze_0/M_AXI_IC] [get_bd_intf_pins axi_smc/S01_AXI]
connect_bd_intf_net [get_bd_intf_pins microblaze_0_axi_intc/interrupt] [get_bd_intf_pins microblaze_0/INTERRUPT]
connect_bd_intf_net [get_bd_intf_pins mdm_1/MBDEBUG_0] [get_bd_intf_pins microblaze_0/DEBUG]
connect_bd_net [get_bd_pins clk_wiz_0/clk_out2] [get_bd_pins syncPulseCounter_0/clk1]
connect_bd_net [get_bd_pins clk_wiz_0/clk_out3] [get_bd_pins syncPulseCounter_0/clk2]
connect_bd_net [get_bd_pins clk_wiz_0/clk_out4] [get_bd_pins syncPulseCounter_0/clk3]
connect_bd_net -net ck_io8_1 [get_bd_ports ck_io8] [get_bd_pins syncPulseCounter_0/gate]
connect_bd_net -net ck_io9_1 [get_bd_ports ck_io9] [get_bd_pins syncPulseCounter_0/pin0]
connect_bd_net -net ck_io11_1 [get_bd_ports ck_io11] [get_bd_pins syncPulseCounter_0/pin2]
connect_bd_net -net ck_io12_1 [get_bd_ports ck_io12] [get_bd_pins syncPulseCounter_0/pin3]
connect_bd_net [get_bd_pins syncPulseCounter_0/memAddr0_out] [get_bd_pins DRAM/a] [get_bd_pins AXI_control/In0]
connect_bd_net [get_bd_pins syncPulseCounter_0/memAddr1_out] [get_bd_pins DRAM/a1] [get_bd_pins AXI_control/In1]
connect_bd_net [get_bd_pins syncPulseCounter_0/memAddr2_out] [get_bd_pins DRAM/a2] [get_bd_pins AXI_control/In2]
connect_bd_net [get_bd_pins syncPulseCounter_0/memAddr3_out] [get_bd_pins DRAM/a3] [get_bd_pins AXI_control/In3]
connect_bd_net [get_bd_pins syncPulseCounter_0/pin0Event_out] [get_bd_pins DRAM/d]
connect_bd_net [get_bd_pins syncPulseCounter_0/pin1Event_out] [get_bd_pins DRAM/d1]
connect_bd_net -net axi_gpio_0_gpio_io_o [get_bd_pins AXI_control/gpio_io_o] [get_bd_pins syncPulseCounter_0/data_uC2FPGA]
connect_bd_net [get_bd_pins syncPulseCounter_0/data_FPGA2uC] [get_bd_pins AXI_control/gpio2_io_i]
connect_bd_net -net xlslice_0_Dout [get_bd_pins AXI_control/Dout] [get_bd_pins DRAM/dpra]
connect_bd_net -net xlslice_1_Dout [get_bd_pins AXI_control/Dout1] [get_bd_pins DRAM/dpra1]
connect_bd_net -net xlslice_2_Dout [get_bd_pins AXI_control/Dout2] [get_bd_pins DRAM/dpra2]
connect_bd_net -net xlslice_3_Dout [get_bd_pins AXI_control/Dout3] [get_bd_pins DRAM/dpra3]
connect_bd_net [get_bd_pins xlconstant_0/dout] [get_bd_pins DRAM/we]
connect_bd_net [get_bd_ports reset] [get_bd_pins clk_wiz_0/resetn] [get_bd_pins mig_7series_0/sys_rst]
connect_bd_net [get_bd_ports sys_clock] [get_bd_pins clk_wiz_0/clk_in1]
connect_bd_net [get_bd_pins syncPulseCounter_0/pin2Event_out] [get_bd_pins DRAM/d2]
connect_bd_net [get_bd_pins syncPulseCounter_0/pin3Event_out] [get_bd_pins DRAM/d3]
connect_bd_net [get_bd_pins DRAM/dpo3] [get_bd_pins AXI_pin/Din]
connect_bd_net [get_bd_pins DRAM/dpo2] [get_bd_pins AXI_pin/Din3]
connect_bd_net [get_bd_pins DRAM/dpo1] [get_bd_pins AXI_pin/Din2]
connect_bd_net -net dist_mem_gen_0_dpo [get_bd_pins DRAM/dpo] [get_bd_pins AXI_pin/Din1]
connect_bd_net [get_bd_pins clk_wiz_0/clk_out7] [get_bd_ports eth_ref_clk]
connect_bd_net [get_bd_pins clk_wiz_0/clk_out5] [get_bd_pins mig_7series_0/clk_ref_i]
connect_bd_net [get_bd_pins clk_wiz_0/clk_out6] [get_bd_pins mig_7series_0/sys_clk_i]
connect_bd_net -net microblaze_0_intr [get_bd_pins microblaze_0_xlconcat/dout] [get_bd_pins microblaze_0_axi_intc/intr]
connect_bd_net -net microblaze_0_Clk [get_bd_pins mig_7series_0/ui_clk] \
  [get_bd_pins microblaze_0/Clk] [get_bd_pins microblaze_0_axi_periph/ACLK] [get_bd_pins microblaze_0_axi_periph/S00_ACLK] \
  [get_bd_pins microblaze_0_axi_periph/M00_ACLK] [get_bd_pins microblaze_0_axi_intc/s_axi_aclk] \
  [get_bd_pins microblaze_0_axi_intc/processor_clk] [get_bd_pins microblaze_0_local_memory/LMB_Clk] \
  [get_bd_pins rst_mig_7series_0_80M/slowest_sync_clk] [get_bd_pins axi_smc/aclk] [get_bd_pins axi_uartlite_0/s_axi_aclk] \
  [get_bd_pins microblaze_0_axi_periph/M01_ACLK] [get_bd_pins axi_ethernetlite_0/s_axi_aclk] \
  [get_bd_pins microblaze_0_axi_periph/M02_ACLK] [get_bd_pins axi_timer_0/s_axi_aclk] \
  [get_bd_pins microblaze_0_axi_periph/M03_ACLK] [get_bd_pins AXI_control/s_axi_aclk] \
  [get_bd_pins microblaze_0_axi_periph/M04_ACLK] [get_bd_pins microblaze_0_axi_periph/M05_ACLK] \
  [get_bd_pins AXI_pin/s_axi_aclk] [get_bd_pins microblaze_0_axi_periph/M06_ACLK] \
  [get_bd_pins microblaze_0_axi_periph/M07_ACLK] [get_bd_pins microblaze_0_axi_periph/M08_ACLK] \
  [get_bd_pins microblaze_0_axi_periph/M09_ACLK] [get_bd_pins AXI_eventCounter/s_axi_aclk] \
  [get_bd_pins microblaze_0_axi_periph/M10_ACLK] [get_bd_pins microblaze_0_axi_periph/M11_ACLK] \
  [get_bd_pins microblaze_0_axi_periph/M12_ACLK] [get_bd_pins microblaze_0_axi_periph/M13_ACLK] \
  [get_bd_pins microblaze_0_axi_periph/M14_ACLK]
connect_bd_net [get_bd_pins mig_7series_0/mmcm_locked] [get_bd_pins rst_mig_7series_0_80M/dcm_locked]
connect_bd_net [get_bd_pins mig_7series_0/ui_clk_sync_rst] [get_bd_pins rst_mig_7series_0_80M/ext_reset_in]
connect_bd_net [get_bd_pins rst_mig_7series_0_80M/mb_reset] [get_bd_pins microblaze_0/Reset] [get_bd_pins microblaze_0_axi_intc/processor_rst]
connect_bd_net [get_bd_pins rst_mig_7series_0_80M/bus_struct_reset] [get_bd_pins microblaze_0_local_memory/SYS_Rst]
connect_bd_net [get_bd_pins rst_mig_7series_0_80M/peripheral_aresetn] \
  [get_bd_pins microblaze_0_axi_periph/ARESETN] [get_bd_pins microblaze_0_axi_periph/S00_ARESETN] \
  [get_bd_pins microblaze_0_axi_periph/M00_ARESETN] [get_bd_pins microblaze_0_axi_intc/s_axi_aresetn] \
  [get_bd_pins mig_7series_0/aresetn] [get_bd_pins axi_smc/aresetn] [get_bd_pins axi_uartlite_0/s_axi_aresetn] \
  [get_bd_pins microblaze_0_axi_periph/M01_ARESETN] [get_bd_pins axi_ethernetlite_0/s_axi_aresetn] \
  [get_bd_pins microblaze_0_axi_periph/M02_ARESETN] [get_bd_pins axi_timer_0/s_axi_aresetn] \
  [get_bd_pins microblaze_0_axi_periph/M03_ARESETN] [get_bd_pins AXI_control/s_axi_aresetn] \
  [get_bd_pins microblaze_0_axi_periph/M04_ARESETN] [get_bd_pins microblaze_0_axi_periph/M05_ARESETN] \
  [get_bd_pins AXI_pin/s_axi_aresetn] [get_bd_pins microblaze_0_axi_periph/M06_ARESETN] \
  [get_bd_pins microblaze_0_axi_periph/M07_ARESETN] [get_bd_pins microblaze_0_axi_periph/M08_ARESETN] \
  [get_bd_pins microblaze_0_axi_periph/M09_ARESETN] [get_bd_pins AXI_eventCounter/s_axi_aresetn] \
  [get_bd_pins microblaze_0_axi_periph/M10_ARESETN] [get_bd_pins microblaze_0_axi_periph/M11_ARESETN] \
  [get_bd_pins microblaze_0_axi_periph/M12_ARESETN] [get_bd_pins microblaze_0_axi_periph/M13_ARESETN] \
  [get_bd_pins microblaze_0_axi_periph/M14_ARESETN]
connect_bd_net [get_bd_pins mdm_1/Debug_SYS_Rst] [get_bd_pins rst_mig_7series_0_80M/mb_debug_sys_rst]
connect_bd_net [get_bd_pins axi_timer_0/interrupt] [get_bd_pins microblaze_0_xlconcat/In0]
connect_bd_net [get_bd_pins axi_ethernetlite_0/ip2intc_irpt] [get_bd_pins microblaze_0_xlconcat/In1]
connect_bd_net [get_bd_pins syncPulseCounter_0/pin0EventCounter_out] [get_bd_pins AXI_eventCounter/gpio_io_i]
connect_bd_net [get_bd_pins syncPulseCounter_0/pin2EventCounter_out] [get_bd_pins AXI_eventCounter/gpio_io_i2]
connect_bd_net [get_bd_pins syncPulseCounter_0/pin3EventCounter_out] [get_bd_pins AXI_eventCounter/gpio_io_i3]
connect_bd_net [get_bd_pins syncPulseCounter_0/pin1EventCounter_out] [get_bd_pins AXI_eventCounter/gpio_io_i1]
connect_bd_net [get_bd_pins clk_wiz_0/clk_out1] [get_bd_pins DRAM/clk] [get_bd_pins syncPulseCounter_0/clk0]
connect_bd_net -net ck_io13_1 [get_bd_ports ck_io13] [get_bd_pins syncPulseCounter_0/pin1]
set_property HDL_ATTRIBUTE.BMM_INFO_PROCESSOR {microblaze-le > design_1 microblaze_0_local_memory/dlmb_bram_if_cntlr} [get_bd_cells microblaze_0]
set_property HDL_ATTRIBUTE.KEEP_HIERARCHY yes [get_bd_cells microblaze_0]

# ---- address map ----
assign_bd_address -offset 0x00000000 -range 32K -target_address_space [get_bd_addr_spaces microblaze_0/Data] [get_bd_addr_segs microblaze_0_local_memory/dlmb_bram_if_cntlr/SLMB/Mem]
assign_bd_address -offset 0x40000000 -range 64K -target_address_space [get_bd_addr_spaces microblaze_0/Data] [get_bd_addr_segs AXI_control/axi_uC_FPGA_communication/S_AXI/Reg]
assign_bd_address -offset 0x40010000 -range 64K -target_address_space [get_bd_addr_spaces microblaze_0/Data] [get_bd_addr_segs AXI_control/axi_gpio_memAddr/S_AXI/Reg]
assign_bd_address -offset 0x40020000 -range 64K -target_address_space [get_bd_addr_spaces microblaze_0/Data] [get_bd_addr_segs AXI_pin/axi_gpio_pin3/S_AXI/Reg]
assign_bd_address -offset 0x40030000 -range 64K -target_address_space [get_bd_addr_spaces microblaze_0/Data] [get_bd_addr_segs AXI_pin/axi_gpio_pin0/S_AXI/Reg]
assign_bd_address -offset 0x40040000 -range 64K -target_address_space [get_bd_addr_spaces microblaze_0/Data] [get_bd_addr_segs AXI_pin/axi_gpio_pin1/S_AXI/Reg]
assign_bd_address -offset 0x40050000 -range 64K -target_address_space [get_bd_addr_spaces microblaze_0/Data] [get_bd_addr_segs AXI_pin/axi_gpio_pin2/S_AXI/Reg]
assign_bd_address -offset 0x40060000 -range 64K -target_address_space [get_bd_addr_spaces microblaze_0/Data] [get_bd_addr_segs AXI_eventCounter/axi_gpio_eventCounter0/S_AXI/Reg]
assign_bd_address -offset 0x40070000 -range 64K -target_address_space [get_bd_addr_spaces microblaze_0/Data] [get_bd_addr_segs AXI_eventCounter/axi_gpio_eventCounter2/S_AXI/Reg]
assign_bd_address -offset 0x40080000 -range 64K -target_address_space [get_bd_addr_spaces microblaze_0/Data] [get_bd_addr_segs AXI_eventCounter/axi_gpio_eventCounter3/S_AXI/Reg]
assign_bd_address -offset 0x40090000 -range 64K -target_address_space [get_bd_addr_spaces microblaze_0/Data] [get_bd_addr_segs AXI_eventCounter/axi_gpio_eventCounter1/S_AXI/Reg]
assign_bd_address -offset 0x40600000 -range 64K -target_address_space [get_bd_addr_spaces microblaze_0/Data] [get_bd_addr_segs axi_uartlite_0/S_AXI/Reg]
assign_bd_address -offset 0x40E00000 -range 64K -target_address_space [get_bd_addr_spaces microblaze_0/Data] [get_bd_addr_segs axi_ethernetlite_0/S_AXI/Reg]
assign_bd_address -offset 0x41200000 -range 64K -target_address_space [get_bd_addr_spaces microblaze_0/Data] [get_bd_addr_segs microblaze_0_axi_intc/S_AXI/Reg]
assign_bd_address -offset 0x41C00000 -range 64K -target_address_space [get_bd_addr_spaces microblaze_0/Data] [get_bd_addr_segs axi_timer_0/S_AXI/Reg]
assign_bd_address -offset 0x80000000 -range 256M -target_address_space [get_bd_addr_spaces microblaze_0/Data] [get_bd_addr_segs mig_7series_0/memmap/memaddr]
assign_bd_address -offset 0x00000000 -range 32K -target_address_space [get_bd_addr_spaces microblaze_0/Instruction] [get_bd_addr_segs microblaze_0_local_memory/ilmb_bram_if_cntlr/SLMB/Mem]
assign_bd_address -offset 0x80000000 -range 256M -target_address_space [get_bd_addr_spaces microblaze_0/Instruction] [get_bd_addr_segs mig_7series_0/memmap/memaddr]

validate_bd_design
save_bd_design
